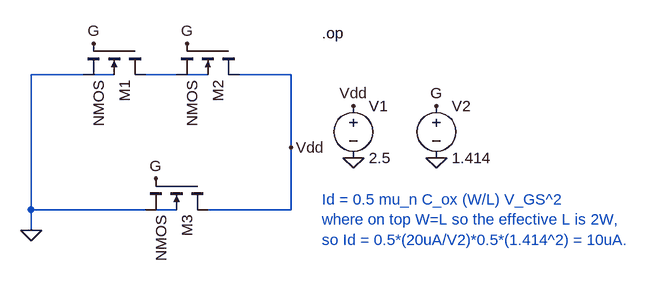
[diagram p0: schematic prob6-1.asc]
prob6-1.asc, the LTspice schematic file:
Version 4
SHEET 1 984 680
WIRE 96 224 16 224
WIRE 144 224 112 224
WIRE 240 224 192 224
WIRE 288 224 256 224
WIRE 416 224 336 224
WIRE 416 336 416 224
WIRE 16 432 16 224
WIRE 192 432 16 432
WIRE 240 432 208 432
WIRE 416 432 416 336
WIRE 416 432 288 432
WIRE 16 464 16 432
FLAG 512 272 Vdd
FLAG 640 272 G
FLAG 512 352 0
FLAG 640 352 0
FLAG 16 464 0
FLAG 112 176 G
FLAG 256 176 G
FLAG 208 384 G
FLAG 416 336 Vdd
SYMBOL nmos4 192 176 R90
SYMATTR InstName M1
SYMBOL nmos4 336 176 R90
SYMATTR InstName M2
SYMBOL nmos4 288 384 R90
SYMATTR InstName M3
SYMATTR Value2 l=0.36 w=0.18
SYMBOL voltage 512 256 R0
SYMATTR InstName V1
SYMATTR Value 2.5
SYMBOL voltage 640 256 R0
SYMATTR InstName V2
SYMATTR Value 1.414
TEXT 464 160 Left 2 !.op
TEXT 464 416 Left 2 ;Id = 0.5 mu_n C_ox (W/L) V_GS^2\nwhere on top W=L so the effective L is 2W, \nso Id = 0.5*(20uA/V2)*0.5*(1.414^2) = 10uA.

The netlist it stands for:
* prob6-1.asc
M1 N002 G 0 N001 NMOS
M2 Vdd G N002 N003 NMOS
M3 Vdd G 0 N004 NMOS l=0.36 w=0.18
V1 Vdd 0 2.5
V2 G 0 1.414
.model NMOS NMOS
.model PMOS PMOS
.lib standard.mos
.op
* Id = 0.5 mu_n C_ox (W/L) V_GS^2
* where on top W=L so the effective L is 2W,
* so Id = 0.5*(20uA/V2)*0.5*(1.414^2) = 10uA.
.backanno
.end